# EAGLE board Proiect_OpenBook V2 v1 (EAGLE 9.7.0)
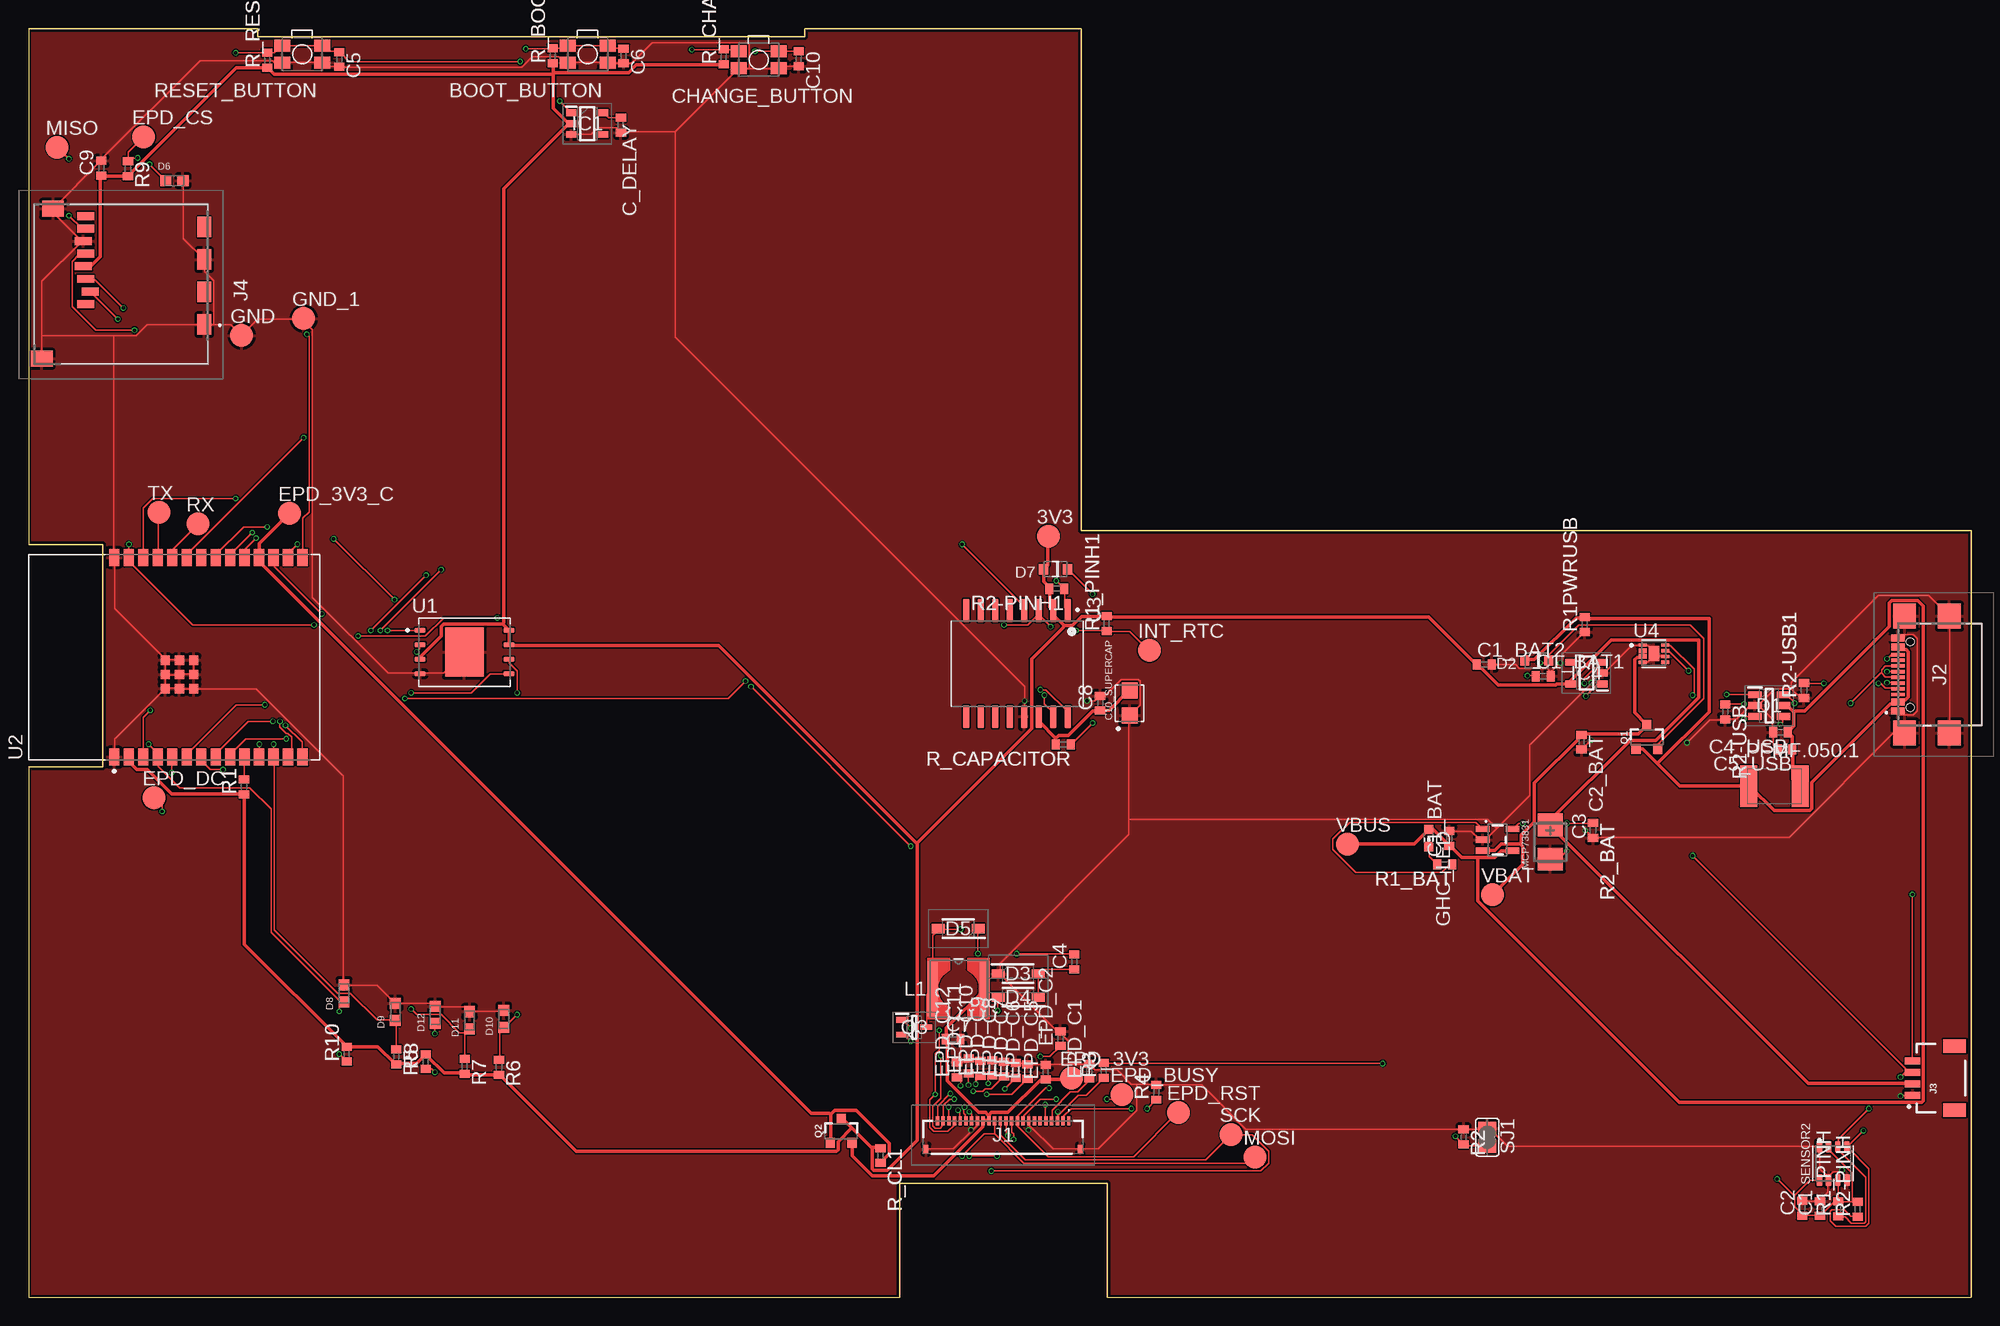
[diagram p1: board, top side]
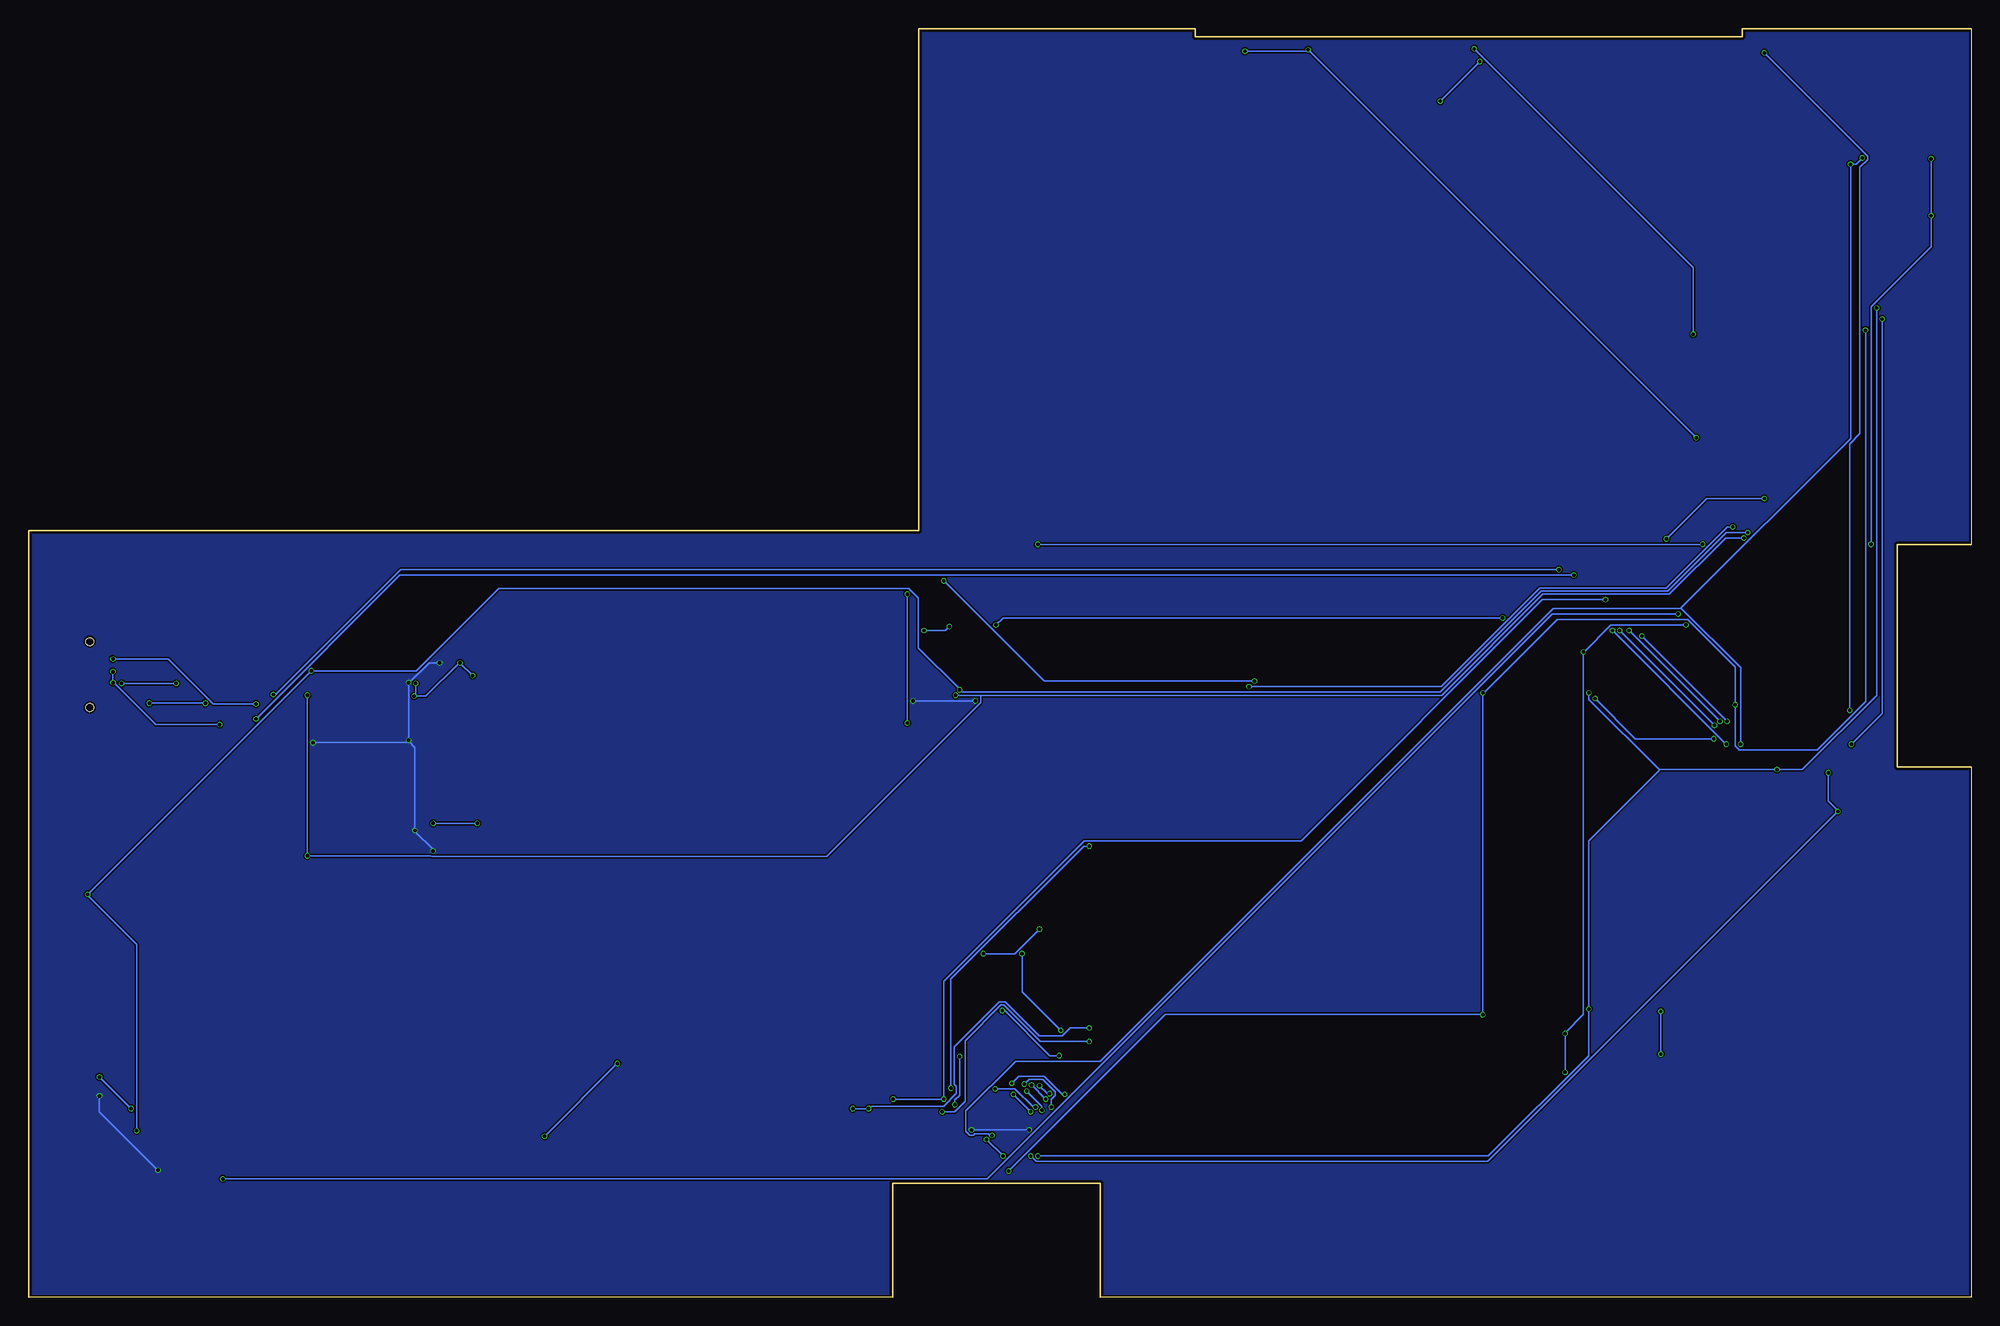
[diagram p2: board, bottom side, seen from below]

Size 170.2 x 111.2 mm. Coordinates in mm from the lower left corner, seen from the top.
Outline: 0,0 76.3,0 76.3,10 94.5,10 94.5,0 170.2,0 170.2,67.2 92.2,67.2 92.2,111.2 68,111.2 68,110.5 20.09,110.5 20.09,111.2 0,111.2 0,66 6.5,66 6.5,46.5 0,46.5 0,0
Copper layers (1*16): Top 0.035mm / dielectric 1.6mm / Bottom 0.035mm
Design rules "jlcpcb-2layers.dru": minimum track width 0.15mm, minimum drill 0.3mm, track to track 5mil, track to pad 5mil, pad to pad 5mil, via to via 5mil, smd to smd 5mil, copper to edge 0.2mm, drill to drill 6mil, minimum pad ring 10mil, minimum via ring 3mil, stop-mask expansion 4mil, vias tented up to drill 0mil, thermal gap 10mil
Net classes: 1 Trasee Putere: width 0.3 mm

## Footprints (pad centres in the part's own frame; a part is rotated, then mirrored left to right if it is on the bottom)
TP20R = smd 2 x 2: TP 0,0
MYBUTTON = smd 1.4 x 1.05: 1 1.75,0.75; 2 -1.75,0.75; 3 -1.75,-0.75; 4 1.75,-0.75
ESP32_WROVER_EAGLE-LTSPICE_C0402 = smd 0.7 x 0.9: 1 -0.65,0; 2 0.65,0
RCL_CT3528 = smd 2 x 2.2: + -1.5,0; - 1.5,0
CAPCP3225X100N = smd 1.4 x 1.4: 1 -1.1,0; 2 1.1,0
SOT95P280X145-6N = smd 1.2 x 0.6: 1 -1.25,0.95; 2 -1.25,0; 3 -1.25,-0.95; 4 1.25,-0.95; 5 1.25,0; 6 1.25,0.95
ESP32_WROVER_AVX---SD0805S020S1R0_AVX_SD0805S020S1R0_0 = smd 0.8 x 0.9: 1 -1.05,0; 2 1.05,0
SOD3716X135N = smd 1.15 x 0.8: 1 -1.75,0; 2 1.75,0
DIOC1608X36N = smd 0.97 x 0.94: 1 -0.75,0; 2 0.75,0
ADAFRUIT_CHIP-LED0603 = smd 0.8 x 0.8: A 0,-0.75; C 0,0.75
SOT95P280X125-5N = smd 0.9 x 0.6: 1 -1.4,0.95; 2 -1.4,0; 3 -1.4,-0.95; 4 1.4,-0.95; 5 1.4,0.95
SOT95P280X120-5N = smd 0.9 x 0.6: 1 -1.4,0.95; 2 -1.4,0; 3 -1.4,-0.95; 4 1.4,-0.95; 5 1.4,0.95
FH34SRJ24S05SH99 = smd 0.3 x 0.8: 1 5.75,1.45; 2 5.25,1.45; 3 4.75,1.45; 4 4.25,1.45; 5 3.75,1.45; 6 3.25,1.45; 7 2.75,1.45; 8 2.25,1.45; 9 1.75,1.45; 10 1.25,1.45; 11 0.75,1.45; 12 0.25,1.45; 13 -0.25,1.45; 14 -0.75,1.45; 15 -1.25,1.45; 16 -1.75,1.45; 17 -2.25,1.45; 18 -2.75,1.45; 19 -3.25,1.45; 20 -3.75,1.45; 21 -4.25,1.45; 22 -4.75,1.45; 23 -5.25,1.45; 24 -5.75,1.45 | smd 0.4 x 0.8: MP1 6.75,-1.05; MP2 -6.75,-1.05
SAMACSYS_PARTS_USB4110GFA = smd 0.3 x 1.15: A1 -3.35,3.678; A4 -2.55,3.678; A5 -1.25,3.678; A6 -0.25,3.678; A7 0.25,3.678; A8 1.25,3.678; A9 2.55,3.678; A12 3.35,3.678; B1 3.05,3.678; B4 2.25,3.678; B5 1.75,3.678; B6 0.75,3.678; B7 -0.75,3.678; B8 -1.75,3.678; B9 -2.25,3.678; B12 -3.05,3.678 | smd 2.18 x 2: MP1 -5.11,-0.827; MP2 5.11,-0.827; MP3 -5.11,3.103; MP4 5.11,3.103 | hole 0.65: -2.89,2.603; 2.89,2.603
JST04_1MM_RA = smd 0.6 x 1.35: 1 -1.5,0; 2 -0.5,0; 3 0.5,0; 4 1.5,0 | smd 1.2 x 2: NC1 2.8,-3.675; NC2 -2.8,-3.675
112ATAARR03ATTEND = smd 1.8 x 1.2: G1 10.6,10.4; G2 4.9,10.4; S1 7.75,10.4; S2 2.05,10.4 | smd 1.4 x 1.9: G3 13.6,-3.85; G4 0.45,-2.85 | smd 0.7 x 1.5: P1 8.8,0; P2 7.7,0.4; P3 6.6,0; P4 5.5,-0.2; P5 4.4,0; P6 3.3,-0.2; P7 2.2,0; P8 1.1,0
IND_4828-WE-TPC_WRE = smd 0.889 x 4.826: 1 -2.286,0; 2 2.286,0
ESP32_WROVER_SPARKFUN-IC-POWER_SOT23-5 = smd 0.55 x 1.2: 1 -0.95,-1.3; 2 0,-1.3; 3 0.95,-1.3; 4 0.95,1.3; 5 -0.95,1.3
ESP32C6_VARISTOR_CT/CN1812 = smd 1.5 x 3.6: 1 -2.25,0; 2 2.25,0
ESP32_WROVER_SPARKFUN-DISCRETESEMI_SOT23-3 = smd 0.8 x 0.9: 1 -0.95,-1; 2 0.95,-1; 3 0,1.1
SOT65P210X110-3N = smd 1.05 x 0.5: 1 -1.05,0.65; 2 -1.05,-0.65; 3 1.05,0
ESP32_WROVER_EAGLE-LTSPICE_R0402 = smd 0.7 x 0.9: 1 -0.65,0; 2 0.65,0
ESP32_WROVER_BME680_PSON80P300X300X100-8N = smd 1.016 x 0.5: 1 1.458,1.2; 2 1.458,0.4; 3 1.458,-0.4; 4 1.458,-1.2; 5 -1.458,-1.22; 6 -1.458,-0.4; 7 -1.458,0.4; 8 -1.458,1.2
SJ = smd 1.168 x 1.6: 1 -0.762,0; 2 0.762,0
SON127P600X800X80-9N = smd 0.94 x 0.44: 1 -3.895,1.905; 2 -3.895,0.635; 3 -3.895,-0.635; 4 -3.895,-1.905; 5 3.895,-1.905; 6 3.895,-0.635; 7 3.895,0.635; 8 3.895,1.905 | smd 3.4 x 4.3: 9 0,0
XCVR_ESP32-C6-WROOM-1-N8 = smd 1.5 x 0.9: 1 -8.75,5.26; 2 -8.75,3.99; 3 -8.75,2.72; 4 -8.75,1.45; 5 -8.75,0.18; 6 -8.75,-1.09; 7 -8.75,-2.36; 8 -8.75,-3.63; 9 -8.75,-4.9; 10 -8.75,-6.17; 11 -8.75,-7.44; 12 -8.75,-8.71; 13 -8.75,-9.98; 14 -8.75,-11.25; 15 8.75,-11.25; 16 8.75,-9.98; 17 8.75,-8.71; 18 8.75,-7.44; 19 8.75,-6.17; 20 8.75,-4.9; 21 8.75,-3.63; 22 8.75,-2.36; 23 8.75,-1.09; 24 8.75,0.18; 25 8.75,1.45; 26 8.75,2.72; 27 8.75,3.99; 28 8.75,5.26 | smd 0.8 x 0.8: 29_1 -2.755,0.79; 29_2 -1.505,0.79; 29_3 -0.255,0.79; 29_4 -2.755,-0.46; 29_5 -1.505,-0.46; 29_6 -0.255,-0.46; 29_7 -2.755,-1.71; 29_8 -1.505,-1.71; 29_9 -0.255,-1.71
SOIC127P1032X265-16N = smd 2.05 x 0.59: 1 -4.655,4.445; 2 -4.655,3.175; 3 -4.655,1.905; 4 -4.655,0.635; 5 -4.655,-0.635; 6 -4.655,-1.905; 7 -4.655,-3.175; 8 -4.655,-4.445; 9 4.655,-4.445; 10 4.655,-3.175; 11 4.655,-1.905; 12 4.655,-0.635; 13 4.655,0.635; 14 4.655,1.905; 15 4.655,3.175; 16 4.655,4.445
SON50P200X200X80-9N = smd 0.76 x 0.27: 1 -0.985,0.75; 4 -0.985,-0.75; 5 0.985,-0.75; 6 0.985,-0.25; 7 0.985,0.25; 8 0.985,0.75 | smd 0.813 x 0.406: 2 -0.985,0.25; 3 -0.985,-0.25 | smd 0.9 x 1.3: 9 0,0

## Placement (x,y rotation side)
3V3  TPTP20R  [TP20R]  89.33,66.71 0 top
BOOT_BUTTON  BUTTON_CUSYOMV1  [MYBUTTON]  48.98,108.95 180 top
C1  100nF  [ESP32_WROVER_EAGLE-LTSPICE_C0402]  156.92,7.8 90 top
C1_BAT  4.7uF  [ESP32_WROVER_EAGLE-LTSPICE_C0402]  124.45,40.23 90 top
C1_BAT1  4.7uF  [ESP32_WROVER_EAGLE-LTSPICE_C0402]  132.68,54.44 0 top
C1_BAT2  4.7uF  [ESP32_WROVER_EAGLE-LTSPICE_C0402]  127.52,55.47 0 top
C2  100nF  [ESP32_WROVER_EAGLE-LTSPICE_C0402]  155.37,7.82 90 top
C2_BAT  4.7uF  [ESP32_WROVER_EAGLE-LTSPICE_C0402]  136.05,48.66 270 top
C3  100uF  [RCL_CT3528]  133.3,39.91 270 top
C4  4.7uF/25V  [ESP32_WROVER_EAGLE-LTSPICE_C0402]  91.61,29.41 90 top
C4_USB  100nF  [ESP32_WROVER_EAGLE-LTSPICE_C0402]  153.47,49.53 180 top
C5  1uF  [ESP32_WROVER_EAGLE-LTSPICE_C0402]  27.21,108.49 270 top
C5_USB  4.7uF  [ESP32_WROVER_EAGLE-LTSPICE_C0402]  153.86,48.03 180 top
C6  100nF  [ESP32_WROVER_EAGLE-LTSPICE_C0402]  52.13,108.8 270 top
C7  10uF  [ESP32_WROVER_EAGLE-LTSPICE_C0402]  80.99,22.63 0 top
C8  100nF  [ESP32_WROVER_EAGLE-LTSPICE_C0402]  93.87,52.08 90 top
C9  100nF  [ESP32_WROVER_EAGLE-LTSPICE_C0402]  6.37,98.96 90 top
C10  100nF  [ESP32_WROVER_EAGLE-LTSPICE_C0402]  67.46,108.54 270 top
C10_SUPERCAP  CPH3225A  [CAPCP3225X100N]  96.46,52.09 90 top
C_DELAY  100nF  [ESP32_WROVER_EAGLE-LTSPICE_C0402]  51.89,102.73 270 top
CHANGE_BUTTON  BUTTON_CUSYOMV1  [MYBUTTON]  63.96,108.45 180 top
D1  USBLC6-2SC6Y  [SOT95P280X145-6N]  152.48,51.87 0 top
D2  ESP32_WROVER_AVX---SD0805S020S1R0_AVX_SD0805S020S1R0_0_0AVX_SD0805S020S1R0_0_0  [ESP32_WROVER_AVX---SD0805S020S1R0_AVX_SD0805S020S1R0_0]  132.11,55.82 180 top
D3  MBR0530  [SOD3716X135N]  86.69,28.37 0 top
D4  MBR0530  [SOD3716X135N]  86.69,26.32 180 top
D5  MBR0530  [SOD3716X135N]  81.44,32.32 180 top
D6  PGB1010603MR  [DIOC1608X36N]  12.78,97.87 0 top
D7  ESP32_WROVER_AVX---SD0805S020S1R0_AVX_SD0805S020S1R0_0_0AVX_SD0805S020S1R0_0_0  [ESP32_WROVER_AVX---SD0805S020S1R0_AVX_SD0805S020S1R0_0]  89.96,63.82 180 top
D8  PGB1010603MR  [DIOC1608X36N]  27.63,26.66 90 top
D9  PGB1010603MR  [DIOC1608X36N]  32.13,25.04 90 top
D10  PGB1010603MR  [DIOC1608X36N]  41.63,24.42 90 top
D11  PGB1010603MR  [DIOC1608X36N]  38.63,24.3 90 top
D12  PGB1010603MR  [DIOC1608X36N]  35.63,24.76 90 top
EPD_3V3  TPTP20R  [TP20R]  91.35,19.21 0 top
EPD_3V3_C  TPTP20R  [TP20R]  22.88,68.71 0 top
EPD_BUSY  TPTP20R  [TP20R]  95.77,17.79 0 top
EPD_C1  1uF/50V  [ESP32_WROVER_EAGLE-LTSPICE_C0402]  92.92,19.84 90 top
EPD_C2  1uF/50V  [ESP32_WROVER_EAGLE-LTSPICE_C0402]  90.4,22.68 90 top
EPD_C5  0.1uF/50V  [ESP32_WROVER_EAGLE-LTSPICE_C0402]  89.11,19.75 90 top
EPD_C6  1uF/50V  [ESP32_WROVER_EAGLE-LTSPICE_C0402]  87.5,19.79 90 top
EPD_C7  1uF/50V  [ESP32_WROVER_EAGLE-LTSPICE_C0402]  86.48,19.9 90 top
EPD_C8  1uF/50V  [ESP32_WROVER_EAGLE-LTSPICE_C0402]  85.45,20.01 90 top
EPD_C9  1uF/50V  [ESP32_WROVER_EAGLE-LTSPICE_C0402]  84.42,20.12 90 top
EPD_C10  1uF/50V  [ESP32_WROVER_EAGLE-LTSPICE_C0402]  83.39,20.07 90 top
EPD_C11  1uF/50V  [ESP32_WROVER_EAGLE-LTSPICE_C0402]  82.36,20.29 90 top
EPD_C12  1uF/50V  [ESP32_WROVER_EAGLE-LTSPICE_C0402]  81.34,19.95 90 top
EPD_CS  TPTP20R  [TP20R]  10.08,101.71 0 top
EPD_DC  TPTP20R  [TP20R]  10.99,43.79 0 top
EPD_RST  TPTP20R  [TP20R]  100.73,16.21 0 top
GHC_LED  [ADAFRUIT_CHIP-LED0603]  122.66,40.25 180 top
GND  TPTP20R  [TP20R]  18.67,84.29 0 top
GND_1  TPTP20R  [TP20R]  24.09,85.79 0 top
IC1  BD5229G-TR  [SOT95P280X125-5N]  48.95,102.87 0 top
IC4  XC6220A331MR-G  [SOT95P280X120-5N]  136.47,54.71 180 top
INT_RTC  TPTP20R  [TP20R]  98.18,56.71 0 top
J1  FH34SRJ-24S-0.5SH_99_  [FH34SRJ24S05SH99]  85.37,14.04 0 top
J2  SAMACSYS_PARTS_USB4110-GF-A  [SAMACSYS_PARTS_USB4110GFA]  167.44,54.59 90 top
J3  QWIIC_RIGHT_ANGLE  [JST04_1MM_RA]  165.04,19.22 90 top
J4  112A-TAAR-R03_ATTEND  [112ATAARR03ATTEND]  5,95.86 270 top
L1  68uH  [IND_4828-WE-TPC_WRE]  81.47,27.05 0 top
MCP73831  ESP32_WROVER_SPARKFUN-IC-POWER_MCP73831  [ESP32_WROVER_SPARKFUN-IC-POWER_SOT23-5]  128.69,40.11 270 top
MISO  TPTP20R  [TP20R]  2.51,100.79 0 top
MOSI  TPTP20R  [TP20R]  107.43,12.29 0 top
PFMF.050.1  ESP32C6_VARISTORCN1812  [ESP32C6_VARISTOR_CT/CN1812]  152.94,44.8 0 top
Q1  20V/4.2A/52mΩ/1.4W  [ESP32_WROVER_SPARKFUN-DISCRETESEMI_SOT23-3]  141.76,49.06 0 top
Q2  20V/4.2A/52mΩ/1.4W  [ESP32_WROVER_SPARKFUN-DISCRETESEMI_SOT23-3]  71.18,14.56 0 top
Q3  SI1308EDL-T1-GE3  [SOT65P210X110-3N]  77.59,23.68 0 top
R1  10K  [ESP32_WROVER_EAGLE-LTSPICE_R0402]  18.87,44.75 90 top
R1_BAT  200  [ESP32_WROVER_EAGLE-LTSPICE_R0402]  124.05,37.95 180 top
R1_PINH  10K  [ESP32_WROVER_EAGLE-LTSPICE_R0402]  158.54,7.77 90 top
R1_PINH1  10K  [ESP32_WROVER_EAGLE-LTSPICE_R0402]  94.46,59.06 90 top
R1PWRUSB  100K  [ESP32_WROVER_EAGLE-LTSPICE_R0402]  136.33,58.97 90 top
R2  2.2  [ESP32_WROVER_EAGLE-LTSPICE_R0402]  125.71,14.07 270 top
R2-PINH  10K  [ESP32_WROVER_EAGLE-LTSPICE_R0402]  160.24,7.72 90 top
R2-PINH1  10K  [ESP32_WROVER_EAGLE-LTSPICE_R0402]  90.07,62.11 180 top
R2-USB  5k1  [ESP32_WROVER_EAGLE-LTSPICE_R0402]  148.63,51.32 270 top
R2-USB1  5k1  [ESP32_WROVER_EAGLE-LTSPICE_R0402]  155.53,53.2 90 top
R2_BAT  2K  [ESP32_WROVER_EAGLE-LTSPICE_R0402]  137.05,40.94 270 top
R3  0.47  [ESP32_WROVER_EAGLE-LTSPICE_R0402]  94.18,19.91 90 top
R4  10K  [ESP32_WROVER_EAGLE-LTSPICE_R0402]  98.79,17.99 90 top
R5  10K  [ESP32_WROVER_EAGLE-LTSPICE_R0402]  32.21,21.09 270 top
R6  10K  [ESP32_WROVER_EAGLE-LTSPICE_R0402]  41.21,20.17 270 top
R7  10K  [ESP32_WROVER_EAGLE-LTSPICE_R0402]  38.21,20.25 270 top
R8  10K  [ESP32_WROVER_EAGLE-LTSPICE_R0402]  34.79,20.67 90 top
R9  10K  [ESP32_WROVER_EAGLE-LTSPICE_R0402]  8.71,98.91 270 top
R10  10K  [ESP32_WROVER_EAGLE-LTSPICE_R0402]  27.87,21.33 90 top
R_BOOT  10K  [ESP32_WROVER_EAGLE-LTSPICE_R0402]  45.93,108.81 90 top
R_CAPACITOR  15  [ESP32_WROVER_EAGLE-LTSPICE_R0402]  90.65,48.46 180 top
R_CHANGE  10K  [ESP32_WROVER_EAGLE-LTSPICE_R0402]  60.91,108.72 90 top
R_CL1  10K  [ESP32_WROVER_EAGLE-LTSPICE_R0402]  74.63,12.44 270 top
R_RESET  10K  [ESP32_WROVER_EAGLE-LTSPICE_R0402]  20.92,108.41 90 top
RESET_BUTTON  BUTTON_CUSYOMV1  [MYBUTTON]  23.97,108.95 180 top
RX  TPTP20R  [TP20R]  14.83,67.79 0 top
SCK  TPTP20R  [TP20R]  105.35,14.29 0 top
SENSOR2  ESP32_WROVER_BME680_BME680  [ESP32_WROVER_BME680_PSON80P300X300X100-8N]  158.08,11.75 90 top
SJ1  [SJ]  127.79,14.04 270 top
TX  TPTP20R  [TP20R]  11.41,68.79 0 top
U1  W25Q512JVEIQ  [SON127P600X800X80-9N]  38.19,56.56 0 top
U2  ESP32-C6-WROOM-1-N8  [XCVR_ESP32-C6-WROOM-1-N8]  12.76,56.1 90 top
U3  DS3231SN#  [SOIC127P1032X265-16N]  86.6,55.55 270 top
U4  MAX17048G+T10  [SON50P200X200X80-9N]  142.38,56.42 0 top
VBAT  TPTP20R  [TP20R]  128.25,35.29 0 top
VBUS  TPTP20R  [TP20R]  115.53,39.71 0 top

## Tracks (layer width: path | path; a pad name or v marks a point on that pad's centre or on a via)
3V3
  Top 0.3: J4.P4 4.85,90.37 5.47,90.37 6.3,91.2 6.3,98.13 C9.1 6.37,98.27 8.66,98.27 R9.2 8.79,98.33 18.21,107.75 R_RESET.1 21.05,107.68 21.54,107.2 45.98,107.2 | 41.55,59 36.36,59 36.15,58.79 36.15,57.96 34.35,56.16 34.35,55.95 U1.3 | 41.55,59 42.03,58.52 U1.8 42.1,58.38 42.1,57.2 U1.7 42.24,57.13 60.45,57.13 77.7,39.89 77.84,39.82 | 45.98,107.34 45.98,108.1 R_BOOT.1 | 45.98,107.34 45.98,107.2 | 45.98,107.2 45.98,104.22 47.3,102.91 47.51,102.91 IC1.2 47.23,102.77 41.62,97.16 41.62,59.14 41.55,59 | 45.98,107.34 52.56,107.34 53.25,108.03 60.87,108.03 R_CHANGE.1 | U2.2 8.79,47.3 8.79,46.95 9.49,46.26 10.39,46.26 12.53,44.11 18.84,44.11 R1.1 18.91,43.97 18.91,30.95 27.77,22.09 R10.2 27.91,21.95 30.61,21.95 32.06,20.5 R5.2 32.27,20.5 34,20.5 34.76,21.26 R8.2 34.9,21.19 36.42,19.67 38.09,19.67 R7.2 38.23,19.6 38.3,19.53 R6.2 41.34,19.46 47.99,12.81 70.77,12.81 70.91,12.95 70.91,13.64 72.12,14.85 | 73.89,13.16 73.82,13.16 72.12,14.85 | 73.89,13.16 74.58,13.16 R_CL1.1 | 72.12,14.85 71.33,15.65 Q2.3 | 90.72,58.86 91.41,58.86 92.24,59.69 94.46,59.69 R1_PINH1.2 94.6,59.62 122.64,59.62 126.73,55.54 C1_BAT2.1 126.94,55.47 128.74,53.67 133.79,53.67 133.86,53.74 135.04,53.74 IC4.5 135.11,53.88 135.11,54.08 138.64,57.62 146.32,57.62 146.32,52.59 142.56,48.82 140.3,48.82 133.31,41.83 133.31,41.55 C3.+ 133.31,41.34 155.88,18.77 165.02,18.77 J3.2 | 90.72,58.86 89.82,59.76 89.82,60.18 U3.2 89.68,60.32 89.47,60.52 89.47,62.05 R2-PINH1.2 89.4,62.26 88.92,62.74 88.92,63.78 D7.2 88.99,63.92 89.26,64.19 89.26,66.69 3V3.TP | 73.89,13.16 73.89,11.29 74.03,11.15 75.21,11.15 77.84,13.78 77.84,39.82
  Top 0.3: 77.84,39.82 87.88,49.86 87.88,55.95 90.65,58.72 90.72,58.86
32KHZ  (via drill 0.3)
  Top 0.15: U3.1 91,60.25 90.79,60.45 90.79,62.05 R2-PINH1.1 v90.03,62.81 | v22.58,48.96 19.04,48.96 17.73,47.64 17.73,47.37 U2.9 | v32.96,52.49 61.29,52.49 v62.81,54.02
  Bottom 0.15: v22.58,48.96 29.43,48.96 v32.96,52.49 | v62.81,54.02 81.23,54.02 v90.03,62.81
DN  (via drill 0.3)
  Top 0.15: v162.81,53.88 163.71,53.88 J2.B7 | v162.81,54.85 163.71,54.85 J2.A7 | v153.46,50.21 153.67,50.41 153.67,50.9 D1.4
  Bottom 0.15: v162.81,54.85 v162.81,53.88 162.74,53.88 159.07,50.21 v153.46,50.21
DP  (via drill 0.3)
  Top 0.15: 162.32,54.71 162.67,54.36 163.71,54.36 J2.A6 | 162.32,54.71 162.32,54.98 162.67,55.33 163.71,55.33 J2.B6 | v154.7,52.08 154.7,52.15 154.08,52.77 153.74,52.77 D1.6 | v159.62,52.08 162.25,54.71 162.32,54.71
  Bottom 0.15: v159.62,52.08 v154.7,52.08
EPD_3V3
  Top 0.3: L1.2 83.79,27.01 80.4,23.61 80.4,22.64 C7.1 80.47,22.51 80.47,18.97 83.24,16.2 83.86,16.2 84,16.07 84.14,16 | EPD_3V3.TP 91.34,19.18 91.27,19.11 89.12,19.11 EPD_C5.1 88.99,19.04 88.64,19.04 85.8,16.2 84.35,16.2 84.14,16 | Q2.2 72.16,13.5 72.16,12.4 73.89,10.66 79.29,10.66 83.58,14.96 83.58,15.37 J1.16 83.65,15.51 84.07,15.51 J1.15 84.14,15.65 84.14,16
EPD_3V3_C
  Top 0.3: 70.29,16.07 70.29,13.57 Q2.1 | 70.29,16.07 70.64,16.41 72.5,16.41 75.41,13.5 75.41,12.6 74.65,11.84 R_CL1.2 | EPD_3V3_C.TP 22.85,68.7 20.22,66.06 20.22,64.89 U2.18 20.29,64.75 20.29,64.4 68.56,16.14 70.15,16.14 70.29,16.07
EPD_BUSY  (via drill 0.3)
  Top 0.15: v90.03,17.38 88.64,17.38 87.19,15.93 87.19,15.51 J1.9 | v94.46,17.38 95.36,17.38 95.7,17.73 EPD_BUSY.TP | v18.14,70.01 10.87,70.01 10.04,69.18 10.04,64.89 U2.26 | v32.06,61.15 v26.73,66.48
  Bottom 0.15: v94.46,17.38 v90.03,17.38 90.03,27.7 77.7,40.03 58.72,40.03 37.6,61.15 v32.06,61.15 | v18.14,70.01 23.2,70.01 v26.73,66.48
EPD_CS  (via drill 0.3)
  Top 0.15: EPD_CS.TP 10.04,101.66 8.73,100.34 8.73,99.58 R9.1 8.79,99.86 v9.56,99.86 | v10.6,99.31 11.98,97.92 D6.1 | v85.8,14.2 85.66,14.34 85.66,15.44 J1.12 | v20.22,48.48 20.22,47.37 U2.11
  Bottom 0.15: v9.56,99.86 10.11,99.31 v10.6,99.31 10.6,75.28 25.41,60.45 25.41,60.39 | v85.8,14.2 86.01,14.2 86.15,14.34 87.32,14.34 87.46,14.2 87.74,14.2 88.09,14.54 88.09,16.34 83.72,20.71 76.31,20.71 36.63,60.39 25.41,60.39 | 25.41,60.39 20.22,55.19 v20.22,48.48
EPD_DC  (via drill 0.3)
  Top 0.15: v86.28,13.85 86.28,14.34 86.15,14.47 86.15,15.44 J1.11 | v82.41,12.4 v84.83,12.4 | v11.7,42.59 11.7,43.07 11.01,43.77 EPD_DC.TP | v12.53,45.98 12.53,47.3 U2.5
  Bottom 0.15: v84.83,12.4 v86.28,13.85 | v82.41,12.4 81.92,11.91 42.38,11.91 v11.7,42.59 11.7,42.66 12.53,43.49 v12.53,45.98
EPD_RST  (via drill 0.3)
  Top 0.15: EPD_RST.TP 100.69,16.2 96.81,12.33 89.33,12.33 86.63,15.03 86.63,15.44 J1.10 86.63,15.51 86.63,15.86 89.12,18.35 v89.4,18.35 | v20.91,67.52 18.84,67.52 16.41,65.09 16.41,64.89 U2.21 | v77.28,39.54 v63.29,53.53
  Bottom 0.15: v20.91,67.52 21.4,67.52 26.73,62.19 37.81,62.19 46.47,53.53 v63.29,53.53 | v77.28,39.54 77.77,39.54 89.4,27.91 v89.4,18.35
FLASH_CS  (via drill 0.3)
  Top 0.15: R5.1 32.2,24.17 32.13,24.24 D9.1 32.06,24.31 30.54,24.31 28.18,26.66 27.08,26.66 21.54,32.2 21.54,47.3 U2.12 21.47,47.37 v21.47,48.48 | v31.44,58.45 34.28,58.45 U1.1
  Bottom 0.15: v21.47,48.48 v31.44,58.45
GDR  (via drill 0.3)
  Top 0.15: v96.6,16.55 91.34,16.55 90.65,15.86 90.65,15.51 J1.2 | v97.99,16.55 98.75,17.31 R4.1 | v77.28,23.61 76.59,24.31 Q3.1
  Bottom 0.15: v97.99,16.55 v96.6,16.55 96.53,16.55 96.33,16.76 90.03,16.76 88.92,17.87 88.92,18.49 89.12,18.7 89.12,21.95 85.18,25.9 84.62,25.9 81.65,22.92 79.64,22.92 78.94,23.61 v77.28,23.61
GND  (via drill 0.3)
  Top 0.15: C5_USB.2 153.18,48.06 152.84,48.41 152.84,49.51 C4_USB.2 152.77,49.58 152.77,50.69 151.59,51.87 D1.2 | D1.2 151.17,51.87 150.83,51.87 149.65,50.69 148.68,50.69 R2-USB.2 148.61,50.62 147.29,50.62 v145.29,48.61 | 154.43,53.32 155.19,52.56 155.47,52.56 R2-USB1.1 | 154.43,53.32 152.97,53.32 151.59,51.94 151.24,51.94 D1.2 | J2.MP1 168.28,49.51 J2.MP2 168.21,59.76 166.48,61.49 162.04,61.49 154.43,53.88 154.43,53.32 | J2.B12 163.78,51.52 163.78,51.24 J2.A1 163.78,51.18 163.78,51.04 | 163.78,51.04 163.78,50.07 164.33,49.51 J2.MP3 163.84,49.93 154.22,40.3 137.12,40.3 R2_BAT.2 137.05,40.3 136.42,40.93 v136.35,40.93 | J2.B1 163.78,57.69 163.78,57.89 J2.A12 163.78,57.96 163.78,58.1 | 163.78,58.1 163.78,59.14 J2.MP4 | 163.78,51.04 165.09,51.04 165.44,51.38 165.44,57.76 165.09,58.1 163.78,58.1 | 134.17,55.64 134.41,55.88 134.41,56.44 136.28,58.31 R1PWRUSB.1 | 134.17,55.64 133.38,54.85 133.38,54.5 C1_BAT1.2 133.31,54.85 133.03,55.12 130.61,55.12 130.26,55.47 128.18,55.47 C1_BAT2.2 | C1_BAT.2 124.51,40.86 126.38,40.86 127.07,40.16 127.35,40.16 MCP73831.2 127.42,40.16 127.7,40.16 128.63,41.1 | U4.4 141.41,55.68 141.82,55.68 142.38,56.23 142.38,56.37 U4.9 | U4.9 142.31,56.44 142.31,56.65 141.82,57.13 141.41,57.13 U4.1 141.34,57.13 140.44,57.13 138.08,54.78 137.88,54.78 IC4.2 137.81,54.78 v136.91,53.88 136.91,53.81 131.51,48.41 131.51,43.97 128.63,41.1 | U4.6 143.35,56.23 142.45,56.23 U4.9 | v136.91,48.82 136.84,48.82 136.08,48.06 C2_BAT.2 | v134.76,39.13 134.07,38.43 133.31,38.43 C3.- | v134.21,55.61 134.17,55.64 | C2.2 155.4,8.45 C1.2 156.92,8.52 157.61,9.21 157.61,10.25 SENSOR2.7
  Top 0.15: SENSOR2.7 157.61,10.32 157.61,10.6 156.92,11.29 156.92,13.16 SENSOR2.1 156.85,13.23 129.57,13.23 128.04,14.75 127.83,14.75 SJ1.1 127.77,14.75 125.76,14.75 R2.1 125.69,14.75 106.64,14.75 102.77,18.63 98.82,18.63 R4.2 98.75,18.7 97.09,18.7 | 158.79,11.01 159.28,10.53 159.28,10.32 SENSOR2.5 | 158.79,11.01 158.1,11.01 157.68,10.6 SENSOR2.7 | v163.98,17.66 165.02,17.66 J3.1 | v158.86,11.15 158.79,11.08 158.79,11.01 | 82.58,14.58 83.1,15.1 83.1,15.44 J1.17 | 82.58,14.58 81.02,13.02 78.67,13.02 J1.MP2 | 87.84,14.92 87.67,15.1 87.67,15.44 J1.8 | 87.84,14.92 89.75,13.02 92.1,13.02 J1.MP1 92.17,13.02 93.69,13.02 97.09,16.41 97.09,18.7 | v82.55,14.68 82.55,14.61 82.58,14.58 | 87.84,14.92 v87.6,14.68 | v92.73,52.28 93.42,52.28 93.83,52.7 C8.2 93.9,52.77 94.32,52.77 95.7,54.15 97.23,54.15 97.36,54.02 97.36,51.94 96.47,51.04 C10_SUPERCAP.1 96.4,50.97 96.4,41.9 | U3.13 87.25,50.9 v87.25,52.28 87.25,53.53 56.65,84.14 56.65,102.14 | C7.2 81.65,22.58 81.65,20.71 EPD_C12.2 81.37,20.64 82.06,20.64 82.34,20.91 EPD_C11.2 82.41,20.91 83.24,20.91 83.38,20.77 EPD_C10.2 83.45,20.77 EPD_C9.2 84.48,20.71 85.39,20.71 EPD_C8.2 85.52,20.64 86.36,20.64 86.42,20.57 EPD_C7.2 86.49,20.5 87.46,20.5 EPD_C6.2 87.53,20.43 89.06,20.43 EPD_C5.2 89.12,20.43 91.06,20.43 | 91.06,20.43 92.86,20.43 EPD_C1.2 92.93,20.43 93.42,19.94 95.36,19.94 96.6,18.7 97.09,18.7 | 91.06,20.43 91.06,22.51 90.44,23.13 90.44,23.27 EPD_C2.2 90.37,23.34 90.09,23.34 85.11,28.32 84.97,28.32 D3.1 85.11,28.39 85.11,29.29 96.4,40.58 96.4,41.9 | 128.63,41.1 127.83,41.9 96.4,41.9 | D10.2 41.62,25.14 41.55,25.07 38.64,25.07 D11.2 38.57,25.07 38.16,25.48 35.66,25.48 D12.2 35.59,25.55 35.39,25.76 32.13,25.76 D9.2 32.06,25.83 30.54,27.35 27.63,27.35 D8.2 27.56,27.42 27.56,45.7 19.94,53.32 14.54,53.32 U2.29_7 14.4,53.32 13.3,53.32 U2.29_4 13.16,53.39 12.05,53.39 U2.29_1
  Top 0.15: U2.29_9 14.47,55.82 14.47,54.64 U2.29_8 14.4,54.64 13.23,54.64 U2.29_5 13.16,54.57 12.05,54.57 U2.29_2 | U2.29_3 11.98,55.88 13.16,55.88 U2.29_6 | U2.29_1 11.98,53.39 11.98,54.57 U2.29_2 | U2.29_3 11.98,55.82 11.98,54.64 U2.29_2 | U2.1 7.55,47.37 7.55,48.96 11.91,53.32 U2.29_1 | U2.29_3 11.98,55.95 7.55,60.39 7.55,64.82 U2.28 7.48,64.89 7.48,84.28 | U1.9 38.16,56.51 36.36,54.71 34.35,54.71 U1.4 34.28,54.71 31.51,54.71 24.86,61.35 24.86,84.83 24.03,85.66 GND_1.TP 24.03,85.73 20.08,85.73 18.7,84.35 GND.TP 18.63,84.35 17.73,85.25 16.2,85.25 | D6.2 13.57,97.85 13.57,92.8 15.37,91 J4.G2 15.44,90.92 15.44,89.89 16.2,89.12 16.2,85.25 | 16.2,85.25 15.44,85.25 J4.G1 15.37,85.25 10.39,85.25 9.42,84.28 7.48,84.28 | IC1.3 47.58,101.94 49.31,101.94 49.86,102.49 51.52,102.49 51.87,102.14 C_DELAY.2 51.94,102.14 56.65,102.14 | C10.2 65.86,107.89 65.72,107.75 CHANGE_BUTTON.2 65.65,107.68 63.16,107.68 | 63.16,107.68 62.26,107.68 CHANGE_BUTTON.1 62.19,107.68 56.65,102.14 | 63.16,107.68 63.16,109.83 63.02,109.97 54.64,109.97 52.84,108.17 52.15,108.17 C6.2 52.08,108.17 50.76,108.17 BOOT_BUTTON.2 50.69,108.24 47.3,108.24 BOOT_BUTTON.1 47.23,108.24 46.95,108.24 46.47,108.72 44.11,108.72 43.21,107.82 27.29,107.82 C5.2 27.15,107.89 26.04,107.89 25.76,108.17 RESET_BUTTON.2 25.69,108.24 22.23,108.24 RESET_BUTTON.1 22.16,108.24 21.54,108.24 21.4,108.38 15.03,108.38 6.3,99.65 C9.2 6.3,99.58 2.15,95.43 J4.G4 2.22,95.36 2.22,95.01 4.64,92.59 4.78,92.59 J4.P6 4.64,92.52 1.18,89.06 1.18,84.28 | 1.18,84.28 1.18,82.27 J4.G3 | 1.18,84.28 7.48,84.28
  Bottom 0.15: v136.91,48.82 v136.91,53.88 136.84,53.88 135.11,55.61 v134.21,55.61 | v136.91,48.82 136.91,48.75 136.35,48.2 v136.35,40.93 136.35,40.86 134.76,39.27 v134.76,39.13 | v145.29,48.61 137.12,48.61 v136.91,48.82 | v163.98,17.66 163.98,16.27 v158.86,11.15 | v87.6,14.68 v82.55,14.68 | v92.73,52.28 v87.25,52.28
  pour Top: -14.72,-17.6 199.08,-17.6 199.08,117.43 -14.72,117.43
  pour Bottom: -14.65,-17.61 198.99,-17.61 198.99,117.13 -14.65,117.13
GPIO8
  Top 0.15: R1.2 18.91,45.43 18.91,47.3 U2.10
I2C_PW  (via drill 0.3)
  Top 0.15: 159.76,8.38 160.18,8.38 R2-PINH.2 | 159.76,8.38 158.58,8.38 R1_PINH.2 | SENSOR2.6 158.51,10.25 158.51,8.45 R1_PINH.2 | 159.76,8.38 159.76,10.87 157.68,12.95 157.68,13.16 SENSOR2.2 | 154.7,8.93 156.02,10.25 156.85,10.25 SENSOR2.8 | 154.7,8.93 154.7,7.96 155.4,7.27 C2.1 155.4,7.2 156.92,7.2 C1.1 156.99,7.2 158.24,8.45 158.44,8.45 R1_PINH.2 | v25.69,59.9 21.54,64.06 21.54,64.82 U2.17 | v153.18,10.39 154.63,8.93 154.7,8.93
  Bottom 0.15: v25.69,59.9 36.7,59.9 86.22,10.39 v153.18,10.39
INT_RTC  (via drill 0.3)
  Top 0.15: INT_RTC.TP 98.13,56.72 96.47,58.38 94.53,58.38 R1_PINH1.1 94.46,58.45 v91.76,58.45 | v21.4,50.48 19.25,50.48 16.41,47.64 16.41,47.37 U2.8 | v28.88,57.96 34.76,57.96 36.36,59.55 v41.06,59.55 | v85.45,58.93 87.53,58.93 88.5,59.9 88.5,60.18 U3.3 88.5,59.83 v89.54,58.79
  Bottom 0.15: v28.88,57.96 v21.4,50.48 | v41.06,59.55 84.83,59.55 v85.45,58.93 | v91.76,58.45 89.89,58.45 v89.54,58.79
IO/BOOT  (via drill 0.3)
  Top 0.15: C6.1 52.08,109.48 50.97,109.48 50.76,109.69 BOOT_BUTTON.3 50.69,109.69 47.3,109.69 BOOT_BUTTON.4 47.02,109.48 45.98,109.48 R_BOOT.2 45.91,109.42 v43.56,109.42 | v24.38,84.42 24.58,84.21 24.58,68.83 24.03,68.28 24.03,64.89 U2.15
  Bottom 0.15: v24.38,84.42 24.38,90.23 v43.56,109.42
IO/CHANGE  (via drill 0.3)
  Top 0.15: C10.1 67.45,109.21 CHANGE_BUTTON.3 65.65,109.21 v63.64,109.21 | CHANGE_BUTTON.4 62.19,109.21 62.05,109.35 60.94,109.35 R_CHANGE.2 60.87,109.35 v58.1,109.35 | U2.23 13.85,65.09 v24.1,75.34
  Bottom 0.15: v24.1,75.34 v58.1,109.35 58.17,109.35 58.31,109.21 v63.64,109.21
MISO  (via drill 0.3)
  Top 0.15: v3.53,94.8 4.64,93.69 4.99,93.69 J4.P7 | v3.53,99.79 2.56,100.76 MISO.TP | v35.59,19.74 35.32,20.01 34.83,20.01 R8.1 | v35.59,23.13 35.59,23.96 D12.1 | v34,56.58 34.28,56.85 34.28,57.13 U1.2 | v25,58.93 14.4,58.93 8.79,64.54 8.79,64.82 U2.27 8.79,64.89 v8.79,66
  Bottom 0.15: v3.53,99.79 v3.53,94.8 3.53,92.1 8.79,86.84 v8.79,66 | v35.59,19.74 v35.59,23.13 35.59,23.2 34,24.79 v34,56.58 33.93,56.58 31.58,58.93 v25,58.93
MOSI  (via drill 0.3)
  Top 0.15: 84.62,14.34 84.62,15.44 J1.14 | 84.62,14.34 87.19,11.77 106.92,11.77 107.41,12.26 MOSI.TP | 38.23,23.2 38.23,20.91 R7.1 | 38.23,23.2 38.57,23.55 D11.1 | v33.52,52.98 38.78,52.98 40.44,54.64 42.03,54.64 U1.5 | v17.04,46.26 15.93,46.26 15.17,47.02 15.17,47.3 U2.7 | v8.31,86.7 5.82,89.19 5.05,89.19 J4.P3 | 38.23,23.2 37.74,23.2 36.15,24.79 34,24.79 v33.52,25.28 | 84.62,14.34 83.72,14.34 v81.78,12.4
  Bottom 0.15: v33.52,52.98 33.52,52.42 27.35,46.26 | 27.35,46.26 v17.04,46.26 14.82,46.26 8.31,52.77 v8.31,86.7 | 27.35,46.26 27.35,46.19 33.52,40.03 v33.52,25.28 33.52,21.19 42.31,12.4 v81.78,12.4
N$2  (via drill 0.3)
  Top 0.15: v150.27,52.01 148.68,52.01 R2-USB.1 | v162.81,55.95 163.15,56.3 163.71,56.3 J2.B5
  Bottom 0.15: v150.27,52.01 154.01,52.01 157.96,55.95 v162.81,55.95
N$3  (via drill 0.3)
  Top 0.15: v157.27,53.81 155.54,53.81 R2-USB1.2 | v162.04,53.81 162.25,53.81 162.67,53.39 163.71,53.39 J2.A5
  Bottom 0.15: v162.04,53.81 v157.27,53.81
N$4  (via drill 0.3)
  Top 0.15: v131.3,54.5 131.99,54.5 C1_BAT1.1 | v132.41,55.61 132.89,55.61 133.1,55.82 D2.1 133.17,55.88 133.17,56.3 135.8,58.93 145.56,58.93 146.74,57.76 146.74,52.49 142.72,48.48 142.72,48.13 Q1.2 | v136.42,52.7 137.46,53.74 137.81,53.74 IC4.1 | v136.28,53.81 136.28,54.22 137.67,55.61 137.81,55.61 IC4.3
  Bottom 0.15: v131.3,54.5 v132.41,55.61 132.47,55.61 135.38,52.7 v136.42,52.7 136.28,52.77 v136.28,53.81
N$5  (via drill 0.3)
  Top 0.15: v80.75,17.87 79.64,16.76 79.64,15.51 J1.24 | v81.65,18.56 81.65,18.97 81.37,19.25 EPD_C12.1
  Bottom 0.15: v80.75,17.87 80.95,17.87 v81.65,18.56
N$6
  Top 0.15: GHC_LED.C 122.71,39.47 122.71,38.64 123.33,38.02 R1_BAT.2
N$7
  Top 0.15: C4.1 91.55,28.74 88.85,28.74 88.5,28.39 D3.2 88.43,28.32 88.43,26.38 D4.1
N$9
  Top 0.15: R1_BAT.1 124.65,37.95 124.51,37.95 123.82,37.26 116.27,37.26 114.26,39.27 114.26,40.16 115.72,41.62 126.8,41.62 127.35,41.06 MCP73831.1
N$10  (via drill 0.3)
  Top 0.15: v134.76,41.55 137.05,41.55 R2_BAT.1 | v130.88,41.55 130.54,41.55 130.05,41.06 MCP73831.5
  Bottom 0.15: v130.88,41.55 v134.76,41.55
N$11
  Top 0.15: C_DELAY.1 51.87,103.39 50.83,103.39 50.41,103.81 IC1.5
N$12  (via drill 0.3)
  Top 0.15: v80.61,16.69 80.61,15.51 J1.22 | v82.96,18.7 82.96,18.97 83.38,19.39 EPD_C10.1
  Bottom 0.15: v80.61,16.69 80.61,17.38 80.26,17.73 80.26,18 81.37,19.11 82.55,19.11 v82.96,18.7
N$14  (via drill 0.3)
  Top 0.15: v81.44,16.41 81.58,16.27 81.58,15.51 J1.20 | v82.75,18.07 83.58,18.07 83.79,18.28 84.35,18.28 85.39,19.32 EPD_C8.1
  Bottom 0.15: v81.44,16.41 81.44,16.76 v82.75,18.07
N$15  (via drill 0.3)
  Top 0.15: v81.99,16.69 81.92,16.62 81.92,16.14 82.06,16 82.06,15.51 J1.19 | v85.52,18.28 86.42,19.18 EPD_C7.1
  Bottom 0.15: v81.99,16.69 82.2,16.69 83.79,18.28 v85.52,18.28
N$16  (via drill 0.3)
  Top 0.15: v82.41,16.27 82.61,16.07 82.61,15.51 J1.18 | v83.93,17.8 86.15,17.8 87.46,19.11 EPD_C6.1
  Bottom 0.15: v83.93,17.8 v82.41,16.27
N$18
  Top 0.15: J1.4 89.68,15.51 89.68,16.41 91.27,18 91.89,18 92.86,18.97 92.86,19.18 EPD_C1.1
N$19  (via drill 0.3)
  Top 0.15: v89.06,16.9 89.06,15.51 J1.5 | v88.64,21.12 89.47,21.12 90.37,22.02 EPD_C2.1
  Bottom 0.15: v89.06,16.9 89.06,17.31 88.64,17.73 v88.64,21.12
N$24  (via drill 0.3)
  Top 0.15: v93.21,50.34 91.34,48.48 R_CAPACITOR.1 | v93.21,61.63 91.06,63.78 D7.1
  Bottom 0.15: v93.21,61.63 v93.21,50.34
PREVGH  (via drill 0.3)
  Top 0.15: v84.07,18.77 84.07,19.11 84.42,19.46 EPD_C9.1 | J1.21 81.09,15.44 81.09,15.1 80.54,14.54 79.29,14.54 78.94,14.89 78.94,17.31 v79.43,17.8 79.43,21.33 79.78,21.68 v79.78,23.41 | v83.17,30.12 83.17,32.27 D5.1
  Bottom 0.15: v79.43,17.8 79.64,17.8 81.23,19.39 83.45,19.39 v84.07,18.77 | v83.17,30.12 83.17,26.8 v79.78,23.41
PREVGL  (via drill 0.3)
  Top 0.15: v81.09,17.38 80.68,17.38 80.12,16.83 80.12,15.51 J1.23 80.05,15.44 80.05,15.03 79.84,14.82 79.43,14.82 79.22,15.03 79.22,16.76 79.92,17.45 v79.92,21.19 | v82.34,18.63 82.34,19.6 EPD_C11.1 | v84.9,25.14 84.9,26.32 D4.2
  Bottom 0.15: v82.34,18.63 v81.09,17.38 | v84.9,25.14 84.69,25.14 80.75,21.19 v79.92,21.19
RESE  (via drill 0.3)
  Top 0.15: 90.34,16.1 91.96,17.73 92.66,17.73 R3.1 | 90.34,16.1 90.16,15.93 90.16,15.51 J1.3 | v77.28,22.44 76.73,22.99 76.59,22.99 Q3.2 | 90.34,16.1 v90.16,16.27
  Bottom 0.15: v77.28,22.44 81.58,22.44 84.76,25.62 85.04,25.62 88.16,22.51 88.16,17.17 89.06,16.27 v90.16,16.27
RESE'  (via drill 0.3)
  Top 0.15: v118.62,20.5 94.25,20.5 R3.2 | v125,14.13 125.69,13.43 R2.2 125.76,13.37 125.83,13.3 127.77,13.3 SJ1.2
  Bottom 0.15: v125,14.13 v118.62,20.5
RESET  (via drill 0.3)
  Top 0.15: v46.54,104.84 47.51,103.88 IC1.1 | v43.07,108.31 28.12,108.31 27.29,109.14 C5.1 27.15,109.21 26.25,109.21 25.76,109.69 RESET_BUTTON.3 25.69,109.69 RESET_BUTTON.4 22.16,109.69 21.54,109.07 20.98,109.07 R_RESET.2 20.84,109.07 v18.14,109.07 | v10.66,51.45 10.04,50.83 10.04,47.37 U2.3
  Bottom 0.15: v43.07,108.31 v46.54,104.84 | v10.66,51.45 10.66,74.79 9.76,75.69 9.76,99.03 9.07,99.72 9.07,100 v18.14,109.07
RTC_RST  (via drill 0.3)
  Top 0.15: v23.55,66 22.78,65.23 22.78,64.89 U2.16 | v81.78,66 87.19,60.59 87.19,60.25 U3.4
  Bottom 0.15: v81.78,66 v23.55,66
RX
  Top 0.15: U2.24 12.6,64.89 12.6,65.51 14.82,67.73 RX.TP
SCK  (via drill 0.3)
  Top 0.15: J1.13 85.18,15.44 85.18,14.2 87.32,12.05 103.11,12.05 105.33,14.27 SCK.TP 105.4,14.27 107.2,14.27 108.65,12.81 108.65,11.77 107.96,11.08 v84.35,11.08 | R6.1 41.27,20.84 41.27,23.27 41.62,23.61 D10.1 41.69,23.68 v42.8,24.79 | v42.8,52.98 42.8,54.91 42.1,55.61 42.1,55.88 U1.6 | U2.6 13.85,47.58 18.21,51.94 v20.71,51.94 | v9.28,84.76 5.89,84.76 3.81,86.84 3.81,90.79 4.43,91.41 4.99,91.41 J4.P5
  Bottom 0.15: v9.28,84.76 9.28,52.22 13.5,47.99 20.36,47.99 20.71,48.34 v20.71,51.94 20.71,55.26 24.86,59.42 36.29,59.42 42.73,52.98 v42.8,52.98 v42.8,24.79 70.64,24.79 v84.35,11.08
SCL  (via drill 0.3)
  Top 0.15: R2-PINH.1 160.18,7.13 159.62,7.13 159.07,7.69 157.96,7.69 157.82,7.55 157.82,6.72 158.31,6.23 160.94,6.23 161.21,6.51 161.21,11.29 159.34,13.16 SENSOR2.4 159.34,13.23 v160.73,14.61 | v145.43,54.91 143.69,56.65 143.42,56.65 U4.7 | v165.02,35.32 165.02,20.77 J3.4 | v19.6,67.03 17.73,65.16 17.73,64.89 U2.20 | v88.64,53.25 89.12,53.25 91,51.38 91,50.9 U3.16
  Bottom 0.15: v160.73,14.61 160.73,30.95 165.02,35.25 v165.02,35.32 v145.43,54.91 136.22,54.91 129.01,62.12 93.07,62.12 92.24,61.29 92.24,56.92 88.64,53.32 v88.64,53.25 88.43,53.05 46.54,53.05 37.67,61.91 26.59,61.91 21.47,67.03 v19.6,67.03
SDA  (via drill 0.3)
  Top 0.15: R1_PINH.1 158.58,7.06 159.14,7.06 159.69,6.51 160.8,6.51 160.94,6.65 160.94,10.53 158.51,12.95 158.51,13.16 SENSOR2.3 158.51,13.23 158.51,13.85 v161.21,16.55 | v145.77,52.77 145.91,52.91 145.91,55.05 143.83,57.13 143.42,57.13 U4.8 | v145.77,38.71 164.75,19.74 165.02,19.74 J3.3 164.54,19.88 v163.98,19.32 | v19.94,66.55 18.97,65.58 18.97,64.89 U2.19 | v88.99,52.77 88.99,52.01 89.75,51.24 89.75,50.9 U3.15
  Bottom 0.15: v145.77,52.77 v145.77,38.71 134.97,38.71 134.9,38.64 100.27,38.64 86.77,52.15 86.77,52.77 | v163.98,19.32 v161.21,16.55 | v19.94,66.55 21.54,66.55 26.45,61.63 37.53,61.63 46.4,52.77 86.77,52.77 | v88.99,52.77 86.77,52.77
SRC  (via drill 0.3)
  Top 0.15: Q3.3 78.67,23.68 78.67,26.52 79.15,27.01 L1.1 79.22,27.08 79.22,31.72 79.71,32.2 D5.2 79.71,32.27 v81.65,32.27 | v86.56,30.12 91.55,30.12 C4.2
  Bottom 0.15: v86.56,30.12 83.79,30.12 v81.65,32.27
SS_SD  (via drill 0.3)
  Top 0.15: v27.21,21.33 27.84,20.71 R10.1 | v27.21,25.07 27.21,25.55 27.56,25.9 D8.1 27.42,25.83 21.26,31.99 21.26,42.8 19.39,44.67 13.23,44.67 11.36,46.54 11.36,47.3 U2.4 11.29,47.37 11.29,47.71 v10.53,48.48 | v7.83,85.73 J4.P2
  Bottom 0.15: v27.21,25.07 v27.21,21.33 | v7.83,85.73 7.83,51.18 v10.53,48.48
TX
  Top 0.15: U2.25 11.36,64.89 11.36,68.77 TX.TP
USB_D+  (via drill 0.3)
  Top 0.15: v148.75,52.84 151.17,52.84 D1.1 | v30.82,58.45 v36.15,63.78 | v22.51,50.14 23.96,48.68 23.96,47.37 U2.14
  Bottom 0.15: v148.75,52.84 148.54,52.84 137.6,63.78 v36.15,63.78 | v22.51,50.14 v30.82,58.45
USB_D-  (via drill 0.3)
  Top 0.15: v150.27,50.69 150.48,50.9 151.17,50.9 D1.3 | v29.98,58.45 v34.83,63.29 | v22.02,50.48 22.02,50 22.58,49.44 22.71,49.44 23.06,49.1 23.06,47.64 22.78,47.37 U2.13
  Bottom 0.15: v150.27,50.69 137.67,63.29 v34.83,63.29 | v22.02,50.48 v29.98,58.45
VBAT
  Top 0.3: 130.68,39.75 129.01,39.75 128.46,39.2 127.42,39.2 MCP73831.3 | 130.68,39.75 130.88,39.54 130.88,37.95 128.25,35.32 VBAT.TP | U4.2 141.41,56.65 141.41,56.23 U4.3 141.27,56.09 140.92,56.09 140.72,55.88 140.72,51.24 141.69,50.28 Q1.3 141.75,50.14 140.99,49.38 136.08,49.38 C2_BAT.1 136.01,49.17 131.92,45.08 131.92,41.69 130.74,40.51 130.74,39.89 130.68,39.75
VBUS
  Top 0.3: 154.63,51.31 154.08,51.87 D1.5 | 154.63,51.31 154.63,50.07 154.22,49.65 C4_USB.1 154.15,49.51 154.5,49.17 154.5,48.06 C5_USB.1 154.57,47.92 154.57,45.43 PFMF.050.1.2 | 126.94,38.57 125.55,38.57 124.58,39.54 C1_BAT.1 124.44,39.61 123.06,41 122.71,41 GHC_LED.A 122.57,40.93 121.39,39.75 115.58,39.75 VBUS.TP | 126.94,38.57 128.46,38.57 129.01,39.13 129.98,39.13 MCP73831.4 | 126.94,38.57 126.94,34.76 144.59,17.11 165.85,17.11 165.99,17.24 165.99,60.59 165.51,61.08 163.22,61.08 163.01,60.87 163.01,58.79 155.6,51.38 154.77,51.38 154.63,51.31
VRTC
  Top 0.3: C10_SUPERCAP.2 96.4,53.18 94.67,51.45 93.9,51.45 C8.1 93.76,51.38 93.21,51.38 91.06,49.24 90.23,49.24 90.09,49.1 89.96,49.03 | 89.96,49.03 89.96,48.48 R_CAPACITOR.2 | 89.96,49.03 88.57,50.41 88.57,50.83 U3.14
VUSB
  Top 0.3: D2.2 131.09,55.88 131.92,55.88 135.59,59.55 136.28,59.55 R1PWRUSB.2 136.42,59.49 147.23,59.49 147.23,51.32 142.69,46.78 | J2.A9 163.78,57.13 163.78,56.85 J2.B4 163.91,56.78 164.47,56.78 164.68,56.58 164.68,52.63 164.4,52.35 163.91,52.35 J2.B9 163.78,52.28 163.78,52.08 J2.A4 163.64,52.01 163.08,52.01 156.23,45.15 156.23,42.87 156.02,42.66 152.9,42.66 150.83,44.74 PFMF.050.1.1 144.66,44.8 142.69,46.78 | 142.69,46.78 141.41,48.06 140.85,48.06 Q1.1